# Altium schematic sheet Pwm.SchDoc
size A; Organization: Altium Limited; Address1: L3, 12a Rodborough Rd; Address2: Frenchs Forest; Address3: NSW; Address4: Australia 2086; DocumentNumber: 2; SheetNumber: 2; SheetTotal: 2
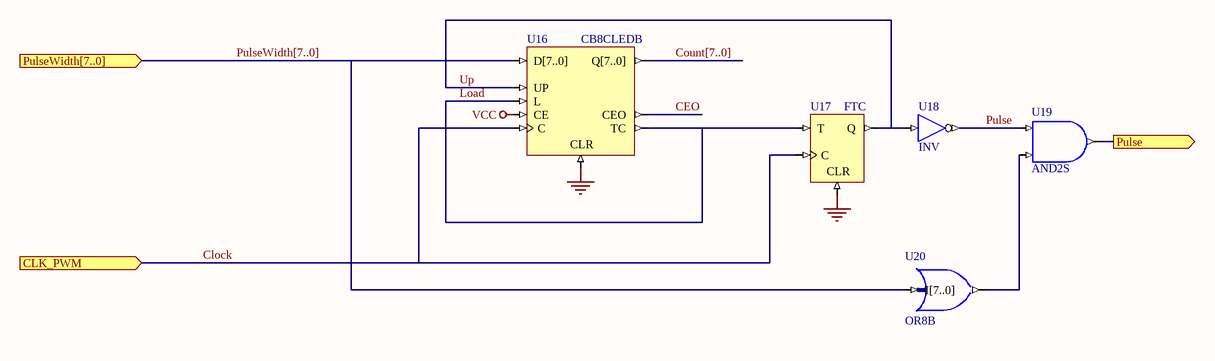
[diagram p0: Pwm.SchDoc]

## Parts
U16  CB8CLEDB
U17  FTC
U18  INV
U19  AND2S
U20  OR8B

## Ports
CLK_PWM (in), Pulse (out), PulseWidth[7..0] (in)

## Nets
GND: U16.CLR U17.CLR
VCC: U16.CE
CEO: U16.CEO
Clock: U16.C U17.C ; port CLK_PWM
Count[7..0]: U16.Q[7..0]
Load: U16.L U16.TC U17.T
Pulse: U18.O U19.I0
Pulse: U19.O ; port Pulse  [a separate net that carries the same name]
PulseWidth[7..0]: U16.D[7..0] U20.I[7..0] ; port PulseWidth[7..0]
Up: U16.UP U17.Q U18.I
NetU19_I1: U19.I1 U20.O

## Buses and harness runs
bus Count[7..0]
bus PulseWidth[7..0] = port PulseWidth[7..0]

## Notes on the sheet
- Title
- Size:
- Date:
- A
- Number:
- Time:
- Revision:
- Sheet
- of
- File:

## Library data of the parts
U16 = CB8CLEDB: 8-Bit Loadable Cascadable Bidirectional Binary Counter with Clock Enable and Asynchronous Clear, Bus Version; ArchiveName: GENERIC; Published: 18-Dec-2003; Publisher: Altium Limited; Core Revision: 1.00.00; Xilinx Equivalent: CB8CLED
U17 = FTC: Toggle Flip-Flop with Toggle Enable and Asynchronous Clear; ArchiveName: GENERIC; Published: 18-Dec-2003; Publisher: Altium Limited; Xilinx Equivalent: FTC; Core Revision: 1.00.00
U18 = INV: Inverter; ArchiveName: GENERIC; Published: 7-Nov-2003; Publisher: Altium Limited; Xilinx Equivalent: INV; Core Revision: 1.00.00
U19 = AND2S: 2-Input AND Gate, Single Pin Version; Xilinx Equivalent: AND2; ArchiveName: GENERIC; Published: 18-Dec-2003; Publisher: Altium Limited; Core Revision: 1.00.00
U20 = OR8B: 8-Input OR Gate, Bus Version; ArchiveName: GENERIC; Published: 18-Dec-2003; Publisher: Altium Limited; Core Revision: 1.00.00